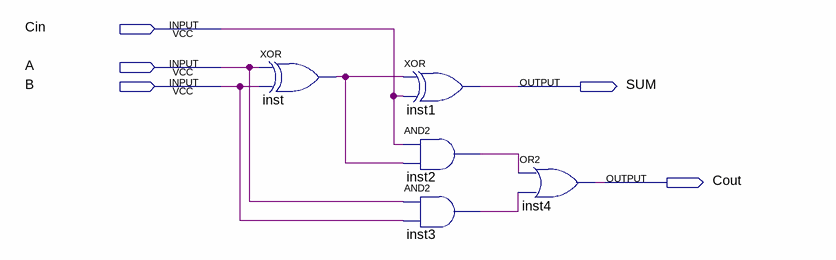
[diagram p0: schematic sheet]
// Quartus schematic FA_1bit.bdf as structural Verilog: 5 symbols, 5 pins
module FA_1bit (
  input  Cin,
  input  A,
  input  B,
  output SUM,
  output Cout
);

  wire inst2_out, inst3_out, inst_out;

  xor inst (inst_out, A, B);
  xor inst1 (SUM, inst_out, Cin);
  and inst2 (inst2_out, Cin, inst_out);
  and inst3 (inst3_out, A, B);
  or inst4 (Cout, inst2_out, inst3_out);
endmodule
